# EAGLE board RASPILOTv1_1 (EAGLE 7.2.0)
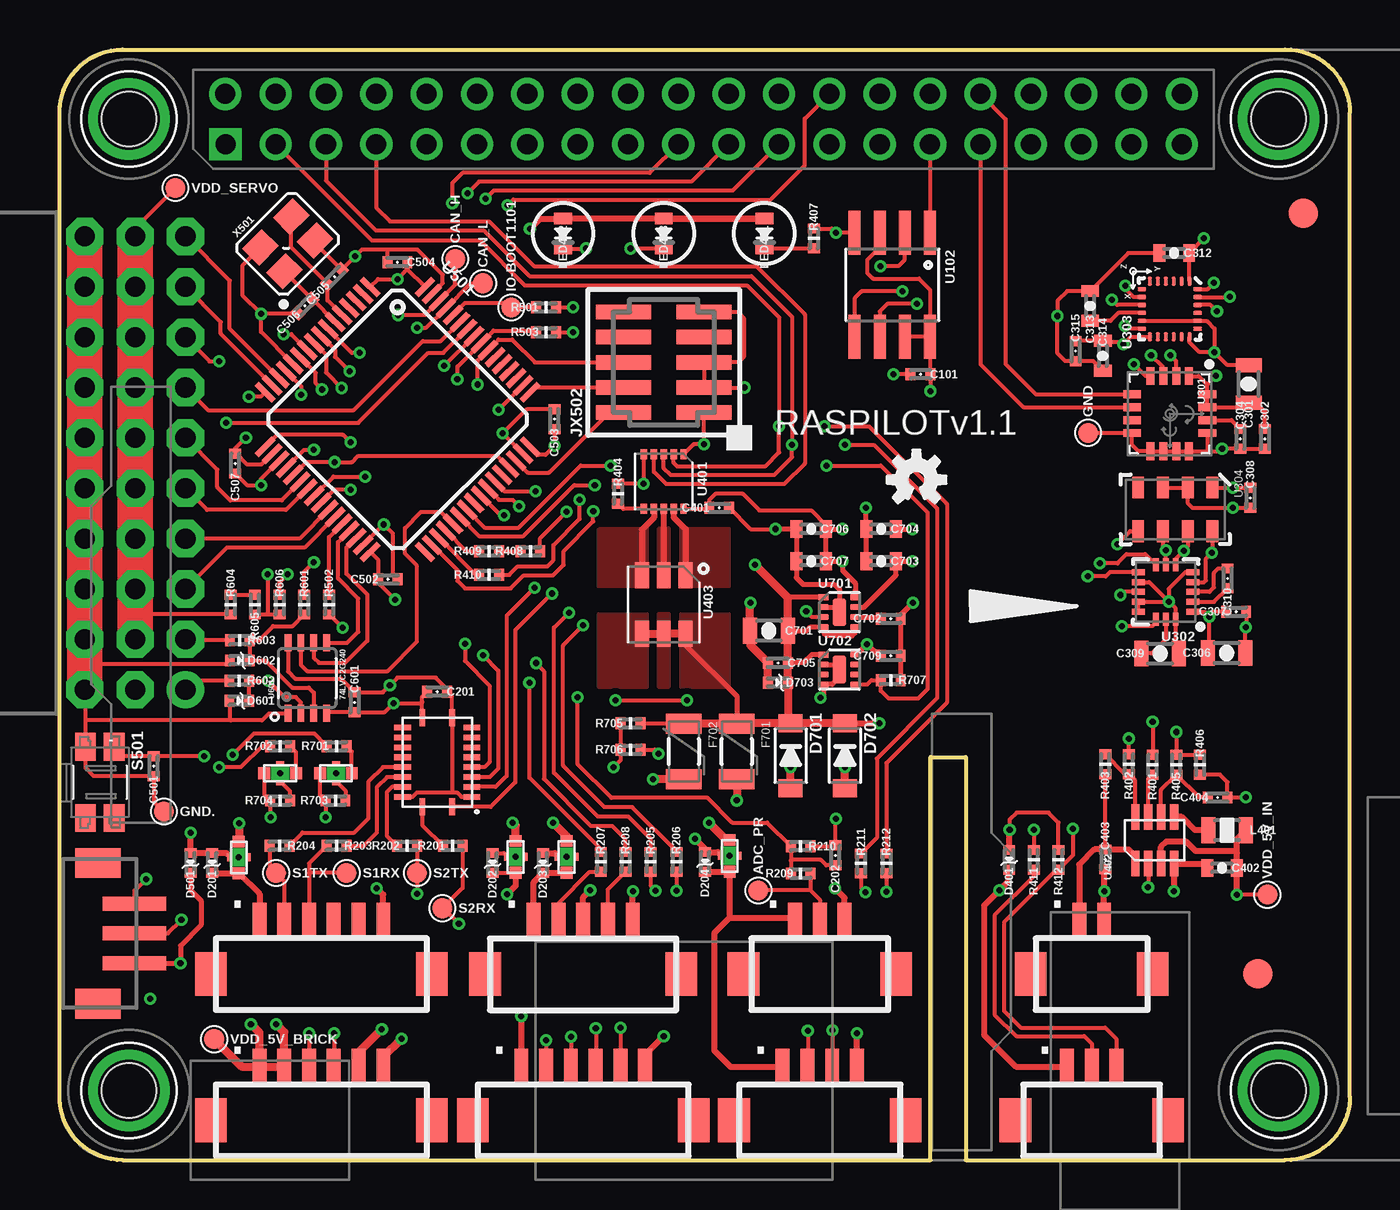
[diagram p8: board, top side]
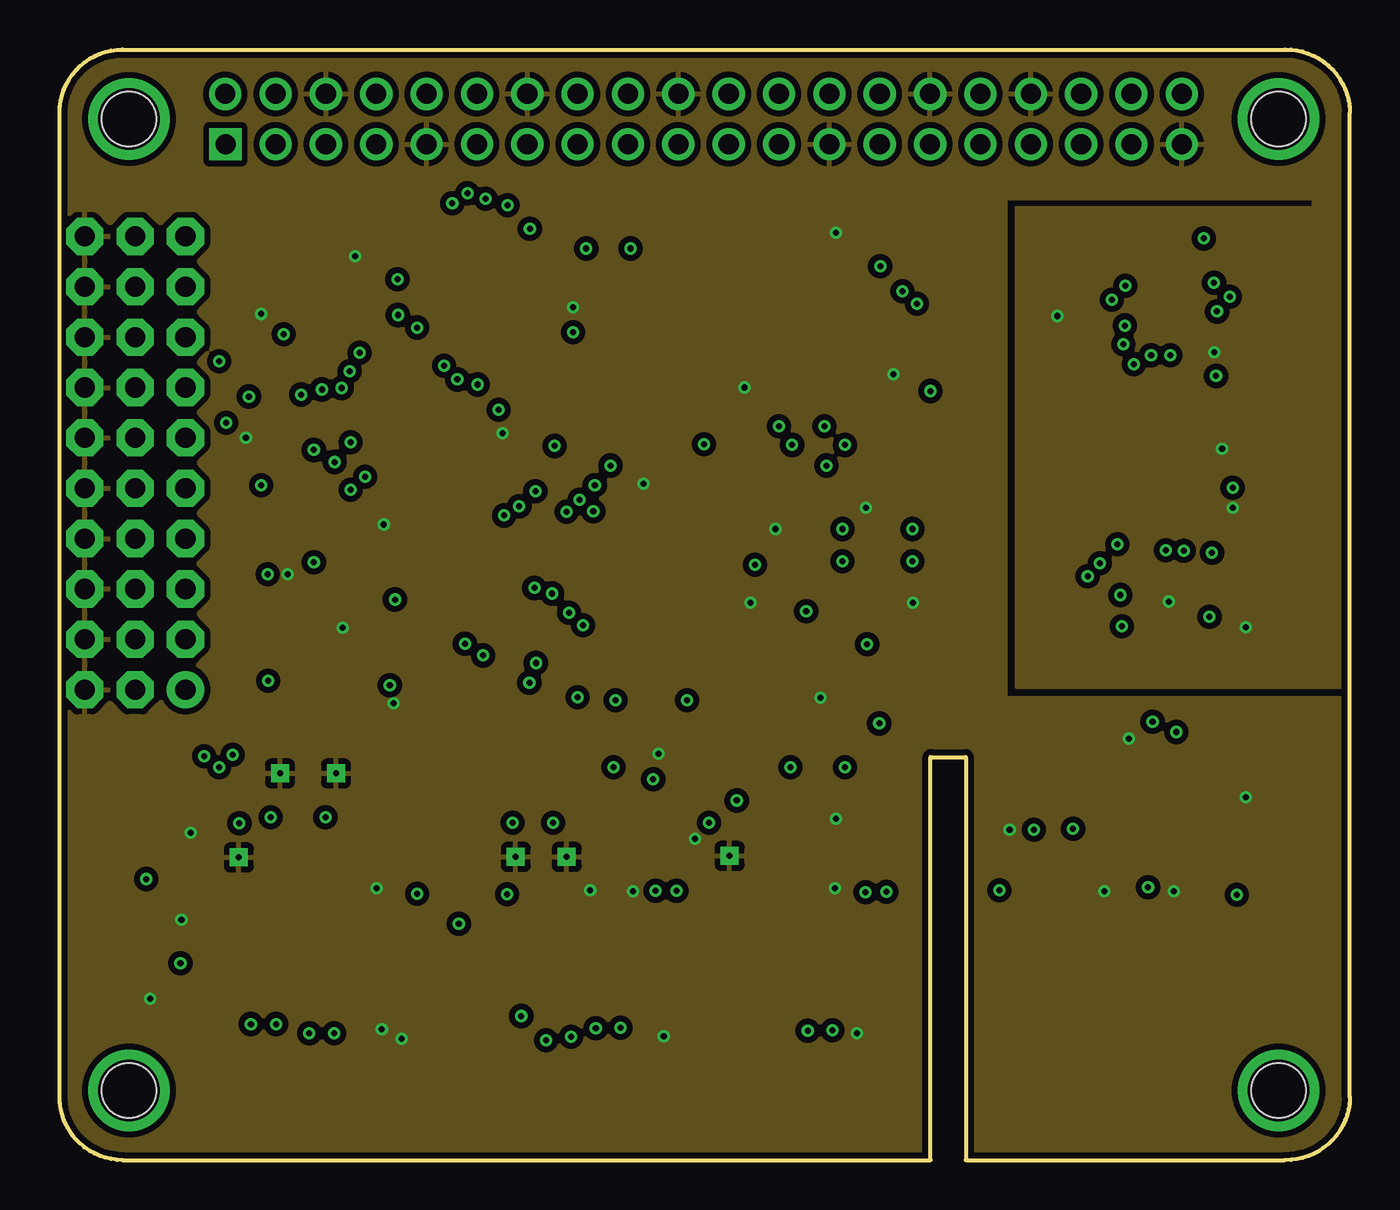
[diagram p9: board, inner layer Ground]
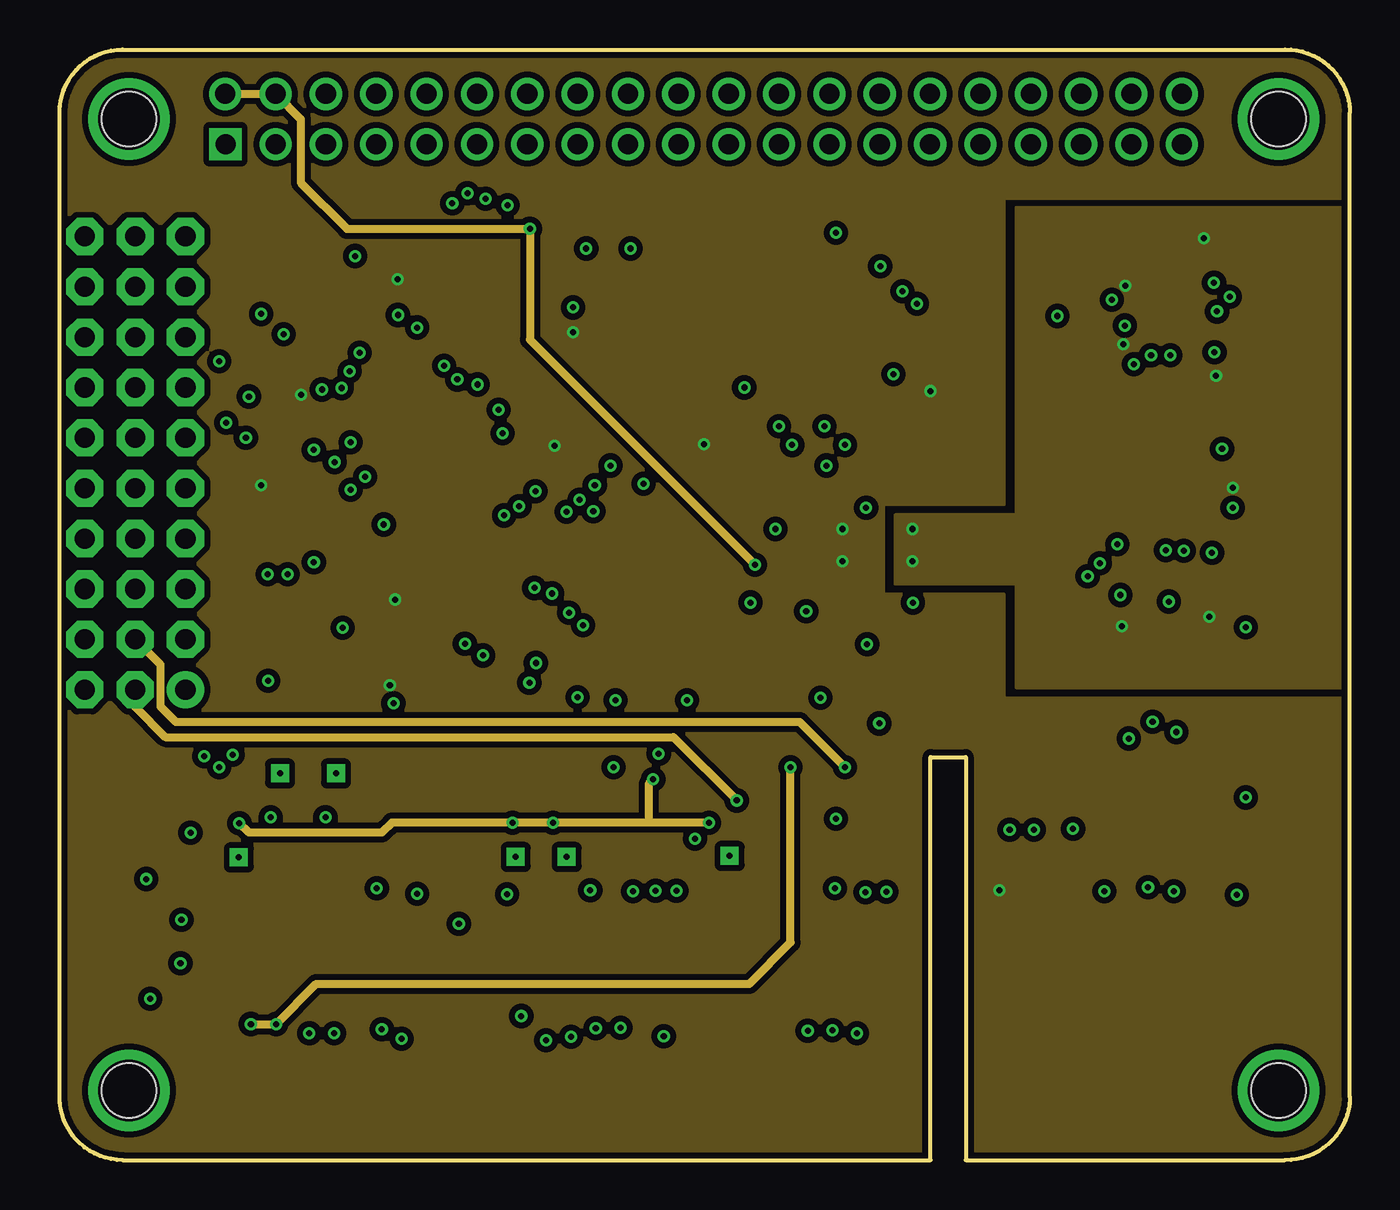
[diagram p10: board, inner layer Power]
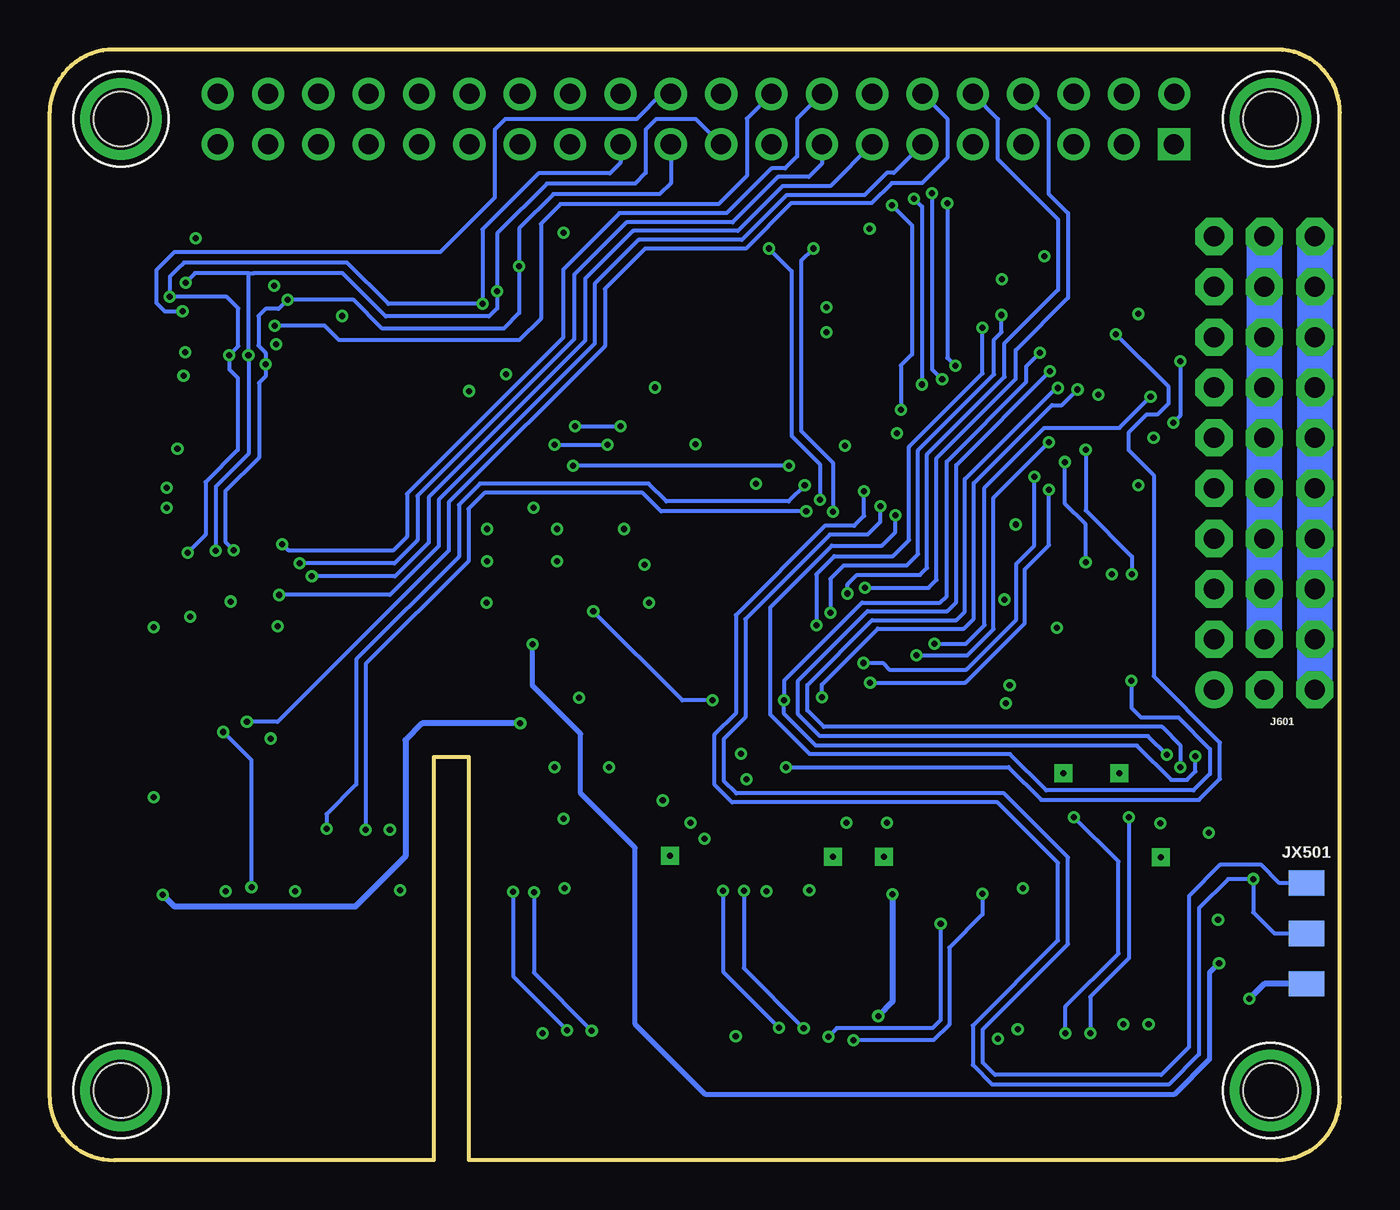
[diagram p11: board, bottom side, seen from below]

Size 65.1 x 56.01 mm. Coordinates in mm from the lower left corner, seen from the top.
Outline: 3.17,56.01 61.82,56.01 arc-90 65.1,52.83 65.1,3.17 arc-90 61.82,0 45.72,0 45.72,20.32 43.94,20.32 43.94,0 3.17,0 arc-90 0,3.17 0,52.83 arc-90 3.17,56.01
Copper layers (1*2*15*16): Top 0.035mm / dielectric 1.5mm / Ground 0.035mm / dielectric 0.15mm / Power 0.035mm / dielectric 0.2mm / Bottom 0.035mm
Design rules "SparkFun-4-layer": minimum track width 6mil, minimum drill 12mil, track to track 6mil, track to pad 6mil, pad to pad 6mil, via to via 6mil, smd to smd 6mil, copper to edge 6mil, drill to drill 8mil, minimum pad ring 12mil, minimum via ring 6mil, stop-mask expansion 4mil, vias tented up to drill 20mil, thermal gap 12mil
Net classes: 0 signal: width 0.15 mm, drill 0.15 mm, clearance 0.152 mm; 1 power: width 0.15 mm, drill 0.2 mm, clearance 0.152 mm

## Footprints (pad centres in the part's own frame; a part is rotated, then mirrored left to right if it is on the bottom)
PAD.04X.04 = smd 1.016 x 1.016: P$1 0,0
0402-CAP = smd 0.5 x 0.6: P$1 -0.5,0; P$2 0.5,0
0805-CAP = smd 0.7 x 1.3: P$1 -0.95,0; P$2 0.95,0
0603-CAP = smd 0.6 x 0.9: P$1 -0.75,0; P$2 0.75,0
0402-TVS = smd 0.5 x 0.6: A 0.5,0; C -0.5,0
SOD-123-DIO = smd 0.91 x 1.22: A 1.64,0; C -1.64,0
PTC-1206 = smd 1 x 1.8: 1 -1.4,0; 2 1.4,0
DF13C-6P-1.25V = smd 0.7 x 1.8: 1 -3.125,0.9; 2 -1.875,0.9; 3 -0.625,0.9; 4 0.625,0.9; 5 1.875,0.9; 6 3.125,0.9 | smd 1.6 x 2.2: M$0 5.575,-1.8; M$1 -5.575,-1.8
DF13C-5P-1.25V = smd 0.7 x 1.8: 1 -2.5,0.9; 2 -1.25,0.9; 3 0,0.9; 4 1.25,0.9; 5 2.5,0.9 | smd 1.6 x 2.2: M$0 4.95,-1.8; M$1 -4.95,-1.8
DF13C-3P-1.25V = smd 0.7 x 1.8: 1 -1.25,0.9; 2 0,0.9; 3 1.25,0.9 | smd 1.6 x 2.2: M$0 3.85,-1.8; M$1 -3.85,-1.8
DF13C-4P-1.25V = smd 0.7 x 1.8: 1 -1.875,0.9; 2 -0.625,0.9; 3 0.625,0.9; 4 1.875,0.9 | smd 1.6 x 2.2: M$0 4.325,-1.8; M$1 -4.325,-1.8
DF13C-2P-1.25V = smd 0.7 x 1.8: 1 -0.625,0.9; 2 0.625,0.9 | smd 1.6 x 2.2: M$0 3.075,-1.8; M$1 -3.075,-1.8
JST-ZH-SMT-VERTICAL = smd 0.7 x 3.2: P$1 -1.5,-1.75; P$2 0,-1.75; P$3 1.5,-1.75 | smd 1.5 x 2.3: P$4 3.55,0.1; P$5 -3.55,0.1
3X10RA = drill 1.016 pad 1.88: 1 2.54,11.43 | drill 1.016 pad 1.88 octagon: 2 0,11.43; 3 -2.54,11.43; 4 2.54,8.89; 5 0,8.89; 6 -2.54,8.89; 7 2.54,6.35; 8 0,6.35; 9 -2.54,6.35; 10 2.54,3.81; 11 0,3.81; 12 -2.54,3.81; 13 2.54,1.27; 14 0,1.27; 15 -2.54,1.27; 16 2.54,-1.27; 17 0,-1.27; 18 -2.54,-1.27; 19 2.54,-3.81; 20 0,-3.81; 21 -2.54,-3.81; 22 2.54,-6.35; 23 0,-6.35; 24 -2.54,-6.35; 25 2.54,-8.89; 26 0,-8.89; 27 -2.54,-8.89; 28 2.54,-11.43; 29 0,-11.43; 30 -2.54,-11.43
FIDUCIAL-1.5X3 = smd 1.5 x 1.5: 1 0,0
HEADER_3X01_SMD_H_BOARD_EDGE_SHORT = smd 1.27 x 1.778: 1 -2.54,0; 2 0,0; 3 2.54,0
FTSH-105-01-XXX-DV-K = smd 0.737 x 2.794: 1 -2.54,-2.032; 2 -2.54,2.032; 3 -1.27,-2.032; 4 -1.27,2.032; 5 0,-2.032; 6 0,2.032; 7 1.27,-2.032; 8 1.27,2.032; 9 2.54,-2.032; 10 2.54,2.032
KYOCERA-KNH16-DA = smd 0.6 x 0.6: P$1 -0.8,0; P$2 0.8,0 | smd 0.4 x 0.4: P$3 0,-0.4; P$4 0,0.4 | drill 0.3 pad 0.4 square: P$5 0,0
0805-IND = smd 0.7 x 1.3: P$1 -0.95,0; P$2 0.95,0
0603-LED = smd 0.6 x 0.9: A 0.75,0; C -0.75,0
MOUNT-HOLE3.1 = drill 3.1 pad 4.1: P$1 0,0
0402-RES = smd 0.5 x 0.6: P$1 -0.5,0; P$2 0.5,0
EVQP7J01K = smd 1.4 x 1.05: A1 -1.8,0.725; A2 1.8,0.725; B3 -1.8,-0.725; B4 1.8,-0.725
RPI2 = drill 1.016 square: P$1 8.37,51.23 | drill 1.016: P$2 8.357,53.772; P$3 10.897,51.232; P$4 10.897,53.772; P$5 13.437,51.232; P$6 13.437,53.772; P$7 15.977,51.232; P$8 15.977,53.772; P$9 18.517,51.232; P$10 18.517,53.772; P$11 21.057,51.232; P$12 21.057,53.772; P$13 23.597,51.232; P$14 23.597,53.772; P$15 26.137,51.232; P$16 26.137,53.772; P$17 28.677,51.232; P$18 28.677,53.772; P$19 31.217,51.232; P$20 31.217,53.772; P$21 33.757,51.232; P$22 33.757,53.772; P$23 36.297,51.232; P$24 36.297,53.772; P$25 38.837,51.232; P$26 38.837,53.772; P$27 41.377,51.232; P$28 41.377,53.772; P$29 43.917,51.232; P$30 43.917,53.772; P$31 46.457,51.232; P$32 46.457,53.772; P$33 48.997,51.232; P$34 48.997,53.772; P$35 51.537,51.232; P$36 51.537,53.772; P$37 54.077,51.232; P$38 54.077,53.772; P$39 56.617,51.232; P$40 56.617,53.772 | hole 2.75: 3.5,3.5; 61.5,3.5; 3.5,52.5; 61.5,52.5
SO08 = smd 0.61 x 2.21: 1 -1.905,-2.616; 2 -0.635,-2.616; 3 0.635,-2.616; 4 1.905,-2.616; 5 1.905,2.616; 6 0.635,2.616; 7 -0.635,2.616; 8 -1.905,2.616
QFN20-RGY = smd 0.28 x 0.85: 1 -0.75,2.25; 10 -0.75,-2.25; 11 0.75,-2.25; 20 0.75,2.25 | smd 0.85 x 0.28: 2 -1.75,1.75; 3 -1.75,1.25; 4 -1.75,0.75; 5 -1.75,0.25; 6 -1.75,-0.25; 7 -1.75,-0.75; 8 -1.75,-1.25; 9 -1.75,-1.75; 12 1.75,-1.75; 13 1.75,-1.25; 14 1.75,-0.75; 15 1.75,-0.25; 16 1.75,0.25; 17 1.75,0.75; 18 1.75,1.25; 19 1.75,1.75
L3G4200DH-MAN = smd 0.9 x 0.4: 1 -1.9,0.975; 2 -1.9,0.325; 3 -1.9,-0.325; 4 -1.9,-0.975; 9 1.9,-0.975; 10 1.9,-0.325; 11 1.9,0.325; 12 1.9,0.975 | smd 0.4 x 0.9: 5 -0.975,-1.9; 6 -0.325,-1.9; 7 0.325,-1.9; 8 0.975,-1.9; 13 0.975,1.9; 14 0.325,1.9; 15 -0.325,1.9; 16 -0.975,1.9
LGA-16L = smd 0.65 x 0.3: 1 -1.37,1; 2 -1.37,0.5; 3 -1.37,0; 4 -1.37,-0.5; 5 -1.37,-1; 9 1.37,-1; 10 1.37,-0.5; 11 1.37,0; 12 1.37,0.5; 13 1.37,1 | smd 0.3 x 0.65: 6 -0.5,-1.37; 7 0,-1.37; 8 0.5,-1.37; 14 0.5,1.37; 15 0,1.37; 16 -0.5,1.37
MPU-6500 = smd 0.45 x 0.22: 1 -1.4,1; 2 -1.4,0.6; 3 -1.4,0.2; 4 -1.4,-0.2; 5 -1.4,-0.6; 6 -1.4,-1; 13 1.4,-1; 14 1.4,-0.6; 15 1.4,-0.2; 16 1.4,0.2; 17 1.4,0.6; 18 1.4,1 | smd 0.22 x 0.45: 7 -1,-1.4; 8 -0.6,-1.4; 9 -0.2,-1.4; 10 0.2,-1.4; 11 0.6,-1.4; 12 1,-1.4; 19 1,1.4; 20 0.6,1.4; 21 0.2,1.4; 22 -0.2,1.4; 23 -0.6,1.4; 24 -1,1.4
MS5611-01BA = smd 1.1 x 0.6: 1 -1.1,1.875; 2 -1.1,0.625; 3 -1.1,-0.625; 4 -1.1,-1.875; 5 1.1,-1.875; 6 1.1,-0.625; 7 1.1,0.625; 8 1.1,1.875
SON10 = smd 0.32 x 0.5: 1 -1,-1.375; 2 -0.5,-1.375; 3 0,-1.375; 4 0.5,-1.375; 5 1,-1.375; 6 1,1.375; 7 0.5,1.375; 8 0,1.375; 9 -0.5,1.375; 10 -1,1.375
SOT23-8 = smd 0.42 x 1.3: 1 -0.975,-1.175; 2 -0.325,-1.175; 3 0.325,-1.175; 4 0.975,-1.175; 5 0.975,1.175; 6 0.325,1.175; 7 -0.325,1.175; 8 -0.975,1.175
6-PLCC = smd 1.3 x 0.7: A1 1.475,1.1; A2 1.475,0; A3 1.475,-1.1; C1 -1.475,1.1; C2 -1.475,0; C3 -1.475,-1.1
TQFP64 = smd 1.2 x 0.29: 1 -5.7,3.75; 2 -5.7,3.25; 3 -5.7,2.75; 4 -5.7,2.25; 5 -5.7,1.75; 6 -5.7,1.25; 7 -5.7,0.75; 8 -5.7,0.25; 9 -5.7,-0.25; 10 -5.7,-0.75; 11 -5.7,-1.25; 12 -5.7,-1.75; 13 -5.7,-2.25; 14 -5.7,-2.75; 15 -5.7,-3.25; 16 -5.7,-3.75; 33 5.7,-3.75; 34 5.7,-3.25; 35 5.7,-2.75; 36 5.7,-2.25; 37 5.7,-1.75; 38 5.7,-1.25; 39 5.7,-0.75; 40 5.7,-0.25; 41 5.7,0.25; 42 5.7,0.75; 43 5.7,1.25; 44 5.7,1.75; 45 5.7,2.25; 46 5.7,2.75; 47 5.7,3.25; 48 5.7,3.75 | smd 0.29 x 1.2: 17 -3.75,-5.7; 18 -3.25,-5.7; 19 -2.75,-5.7; 20 -2.25,-5.7; 21 -1.75,-5.7; 22 -1.25,-5.7; 23 -0.75,-5.7; 24 -0.25,-5.7; 25 0.25,-5.7; 26 0.75,-5.7; 27 1.25,-5.7; 28 1.75,-5.7; 29 2.25,-5.7; 30 2.75,-5.7; 31 3.25,-5.7; 32 3.75,-5.7; 49 3.75,5.7; 50 3.25,5.7; 51 2.75,5.7; 52 2.25,5.7; 53 1.75,5.7; 54 1.25,5.7; 55 0.75,5.7; 56 0.25,5.7; 57 -0.25,5.7; 58 -0.75,5.7; 59 -1.25,5.7; 60 -1.75,5.7; 61 -2.25,5.7; 62 -2.75,5.7; 63 -3.25,5.7; 64 -3.75,5.7
TSSOP8_SOT505-2 = smd 0.35 x 0.85: 1 -0.975,-1.775; 2 -0.325,-1.775; 3 0.325,-1.775; 4 0.975,-1.775; 5 0.975,1.775; 6 0.325,1.775; 7 -0.325,1.775; 8 -0.975,1.775
MLF-8-EPAD = smd 0.5 x 0.3: 1 -0.8,0.75; 2 -0.8,0.25; 3 -0.8,-0.25; 4 -0.8,-0.75; 5 0.8,-0.75; 6 0.8,-0.25; 7 0.8,0.25; 8 0.8,0.75 | smd 0.7 x 1.4: GND 0,0
OSCILLATOR-3.2X2.5 = smd 1.4 x 1.2: 1 -1.1,-0.85; 2 1.1,-0.85; 3 1.1,0.85; 4 -1.1,0.85

## Placement (x,y rotation side)
ADC_PR  PAD.04  [PAD.04X.04]  35.26,13.59 90 top
C101  0u1  [0402-CAP]  43.43,39.62 180 top
C201  0u1  [0402-CAP]  19.05,23.62 180 top
C202  0u1  [0402-CAP]  39.14,15.37 90 top
C301  10u/10V  [0805-CAP]  59.99,39.14 90 top
C302  0u1  [0402-CAP]  60.81,36.37 270 top
C304  10n  [0402-CAP]  59.56,36.37 270 top
C306  10u/10V  [0805-CAP]  58.88,25.58 0 top
C307  0u1  [0402-CAP]  59.36,27.66 0 top
C308  0u1  [0402-CAP]  60.07,33.4 270 top
C309  10u/10V  [0805-CAP]  55.52,25.55 0 top
C310  0u47  [0402-CAP]  58.93,29.34 90 top
C312  10n  [0603-CAP]  56.24,45.75 180 top
C313  2u2  [0603-CAP]  51.99,43.08 90 top
C314  2u2  [0603-CAP]  52.63,40.56 270 top
C315  0u1  [0402-CAP]  51.26,40.79 270 top
C401  0u1  [0402-CAP]  33.27,32.89 0 top
C402  1u  [0603-CAP]  58.65,14.73 180 top
C403  5n6  [0402-CAP]  52.76,15.16 270 top
C404  0u47  [0402-CAP]  58.42,18.29 0 top
C501  0u1  [0402-CAP]  4.75,19.86 90 top
C502  0u1  [0402-CAP]  16.56,29.29 0 top
C503  0u1  [0402-CAP]  24.97,37.36 90 top
C504  0u1  [0402-CAP]  17.04,45.29 180 top
C505  8p  [0402-CAP]  13.87,44.55 45 top
C506  8p  [0402-CAP]  12.37,43.08 45 top
C507  0u1  [0402-CAP]  8.86,35.13 90 top
C601  0u1  [0402-CAP]  14.88,23.09 270 top
C701  10u/25V  [0805-CAP]  35.79,26.7 180 top
C702  10n  [0402-CAP]  41.94,27.3 0 top
C703  1u  [0603-CAP]  41.45,30.2 180 top
C704  10u  [0603-CAP]  41.45,31.83 180 top
C705  0u1  [0402-CAP]  36.25,25.07 180 top
C706  1u  [0603-CAP]  37.92,31.83 180 top
C707  10u  [0603-CAP]  37.92,30.2 180 top
C709  2u2  [0402-CAP]  41.94,25.43 0 top
CAN_H  PAD.04  [PAD.04X.04]  19.96,45.44 90 top
CAN_L  PAD.04  [PAD.04X.04]  21.36,44.22 90 top
D201  PESD0402-140  [0402-TVS]  7.7,14.99 90 top
D202  PESD0402-140  [0402-TVS]  21.84,14.99 90 top
D203  PESD0402-140  [0402-TVS]  24.38,14.99 90 top
D204  PESD0402-140  [0402-TVS]  32.56,15.04 90 top
D401  PESD0402-140  [0402-TVS]  47.9,15.14 90 top
D501  PESD0402-140  [0402-TVS]  6.6,14.99 90 top
D601  PESD0402-140  [0402-TVS]  9.07,23.16 180 top
D602  PESD0402-140  [0402-TVS]  9.09,25.2 180 top
D701  MBR120VLSFT1G  [SOD-123-DIO]  36.88,20.4 270 top
D702  MBR120VLSFT1G  [SOD-123-DIO]  39.62,20.4 270 top
D703  PESD0402-140  [0402-TVS]  36.25,24.08 180 top
F701  0ZCA0035FF2G  [PTC-1206]  34.16,20.6 270 top
F702  0ZCA0035FF2G  [PTC-1206]  31.5,20.6 270 top
GND  PAD.04  [PAD.04X.04]  51.89,36.68 90 top
GND.  PAD.04  [PAD.04X.04]  5.26,17.58 0 top
IO-BOOT1101  PAD.04  [PAD.04X.04]  22.78,43 90 top
J201  DF13C-6P-1.25V  [DF13C-6P-1.25V]  13.21,11.18 0 top
J202  DF13C-6P-1.25V  [DF13C-6P-1.25V]  26.42,3.81 0 top
J203  DF13C-5P-1.25V  [DF13C-5P-1.25V]  26.42,11.18 0 top
J204  DF13C-3P-1.25V  [DF13C-3P-1.25V]  38.35,11.18 0 top
J205  DF13C-4P-1.25V  [DF13C-4P-1.25V]  38.35,3.81 0 top
J401  DF13C-2P-1.25V  [DF13C-2P-1.25V]  52.07,11.18 0 top
J402  DF13C-3P-1.25V  [DF13C-3P-1.25V]  52.07,3.81 0 top
J501  JST-ZH-3  [JST-ZH-SMT-VERTICAL]  2.03,11.43 90 top
J601  HEADER-3X10  [3X10RA]  3.81,35.15 180 bottom
J701  DF13C-6P-1.25V  [DF13C-6P-1.25V]  13.21,3.81 0 top
JP1  FIDUCIAL1.5X3  [FIDUCIAL-1.5X3]  62.74,47.75 0 top
JP2  FIDUCIAL1.5X3  [FIDUCIAL-1.5X3]  60.45,9.4 0 top
JX501  HEADER-3X1BOARDEDGE-SHORT  [HEADER_3X01_SMD_H_BOARD_EDGE_SHORT]  1.68,11.43 270 bottom
JX502  ARM_MINI_JTAG-SMT  [FTSH-105-01-XXX-DV-K]  30.48,40.23 90 top
L201  KNH16C104DA5TS  [KYOCERA-KNH16-DA]  9.04,15.27 270 top
L202  KNH16C104DA5TS  [KYOCERA-KNH16-DA]  23.01,15.29 270 top
L203  KNH16C104DA5TS  [KYOCERA-KNH16-DA]  25.58,15.29 270 top
L204  KNH16C104DA5TS  [KYOCERA-KNH16-DA]  33.81,15.34 270 top
L401  47uH  [0805-IND]  58.9,16.64 180 top
L701  KNH16C104DA5TS  [KYOCERA-KNH16-DA]  11.13,19.51 0 top
L702  KNH16C104DA5TS  [KYOCERA-KNH16-DA]  13.94,19.51 0 top
LED401  GREEN  [0603-LED]  35.56,46.74 90 top
LED402  AMBER  [0603-LED]  25.4,46.74 90 top
LED403  BLUE  [0603-LED]  30.48,46.74 90 top
M3_MOUNT1101  MOUNT-HOLE3.1MM  [MOUNT-HOLE3.1]  3.51,3.51 0 top
M3_MOUNT1102  MOUNT-HOLE3.1MM  [MOUNT-HOLE3.1]  61.49,3.51 0 top
M3_MOUNT1103  MOUNT-HOLE3.1MM  [MOUNT-HOLE3.1]  61.49,52.5 0 top
M3_MOUNT1104  MOUNT-HOLE3.1MM  [MOUNT-HOLE3.1]  3.51,52.5 0 top
OSHW_LOGO  OSHW-LOGOS  [OSHW-LOGO-S]  43.23,34.32 0 top
R201  120R  [0402-RES]  19.84,15.85 0 top
R202  120R  [0402-RES]  17.53,15.85 0 top
R203  120R  [0402-RES]  13.97,15.85 180 top
R204  120R  [0402-RES]  11.1,15.85 180 top
R205  120R  [0402-RES]  29.82,15.04 270 top
R206  120R  [0402-RES]  31.11,15.04 270 top
R207  10K/0.1%  [0402-RES]  27.3,15.04 270 top
R208  10K/0.1%  [0402-RES]  28.55,15.04 270 top
R209  10K/0.1%  [0402-RES]  37.39,14.45 0 top
R210  10K/0.1%  [0402-RES]  37.39,15.82 180 top
R211  120R  [0402-RES]  40.44,14.96 270 top
R212  120R  [0402-RES]  41.71,14.96 270 top
R401  9K09  [0402-RES]  55.14,19.94 90 top
R402  10K  [0402-RES]  53.95,19.96 90 top
R403  100K  [0402-RES]  52.76,19.96 90 top
R404  10K  [0402-RES]  28.17,33.6 270 top
R405  453K  [0402-RES]  56.34,19.94 90 top
R406  16K5  [0402-RES]  57.53,19.94 270 top
R407  220R  [0402-RES]  38.05,46.48 270 top
R408  220R  [0402-RES]  23.75,30.71 0 top
R409  220R  [0402-RES]  21.67,30.71 0 top
R410  220R  [0402-RES]  21.67,29.51 0 top
R411  68R  [0402-RES]  49.15,15.14 90 top
R412  1K5  [0402-RES]  50.39,15.14 90 top
R501  10K  [0402-RES]  24.54,43 0 top
R502  10K  [0402-RES]  13.59,28.02 270 top
R503  10K  [0402-RES]  24.54,41.76 0 top
R601  10K  [0402-RES]  12.34,28.02 270 top
R602  220R  [0402-RES]  9.07,24.18 180 top
R603  220R  [0402-RES]  9.09,26.21 180 top
R604  10K/0.1%  [0402-RES]  8.64,28.02 270 top
R605  10K/0.1%  [0402-RES]  9.86,28.02 90 top
R606  10K/0.1%  [0402-RES]  11.1,28.02 270 top
R701  10K/0.1%  [0402-RES]  13.97,20.88 0 top
R702  10K/0.1%  [0402-RES]  11.13,20.88 0 top
R703  1M  [0402-RES]  13.92,18.14 0 top
R704  1M  [0402-RES]  11.13,18.14 0 top
R705  10K/0.1%  [0402-RES]  28.8,22.02 0 top
R706  10K/0.1%  [0402-RES]  28.8,20.7 0 top
R707  10K  [0402-RES]  41.94,24.21 180 top
S1RX  PAD.04  [PAD.04X.04]  14.48,14.48 0 top
S1TX  PAD.04  [PAD.04X.04]  10.92,14.48 0 top
S2RX  PAD.04  [PAD.04X.04]  19.3,12.7 0 top
S2TX  PAD.04  [PAD.04X.04]  18.03,14.48 0 top
S501  RESET  [EVQP7J01K]  2.03,19.05 270 top
U101  RPI2  [RPI2]  0,0 0 top
U102  FM25V01  [SO08]  42.01,44.15 180 top
U201  TXS0108QFN20  [QFN20-RGY]  19.05,20.07 180 top
U301  L3GD20  [L3G4200DH-MAN]  56.01,37.64 270 top
U302  LSM303D  [LGA-16L]  55.8,28.65 180 top
U303  MPU-9250  [MPU-6500]  56.01,42.93 270 top
U304  MS5611-01BA  [MS5611-01BA]  56.29,32.82 270 top
U401  TCA62724FMG  [SON10]  30.48,34.21 180 top
U402  LT3469  [SOT23-8]  55.24,16.13 0 top
U403  LRTB GFTG-T7AW-1+V7A7-29+R5T9-49-L  [6-PLCC]  30.48,28.02 270 top
U501  STM32F10XRXT6L  [TQFP64]  17.05,37.35 315 top
U601  74LVC2G240  [TSSOP8_SOT505-2]  12.5,24.31 0 top
U701  MIC5332  [MLF-8-EPAD]  39.34,27.64 0 top
U702  MIC5332  [MLF-8-EPAD]  39.34,24.74 0 top
VDD_5V_BRICK  PAD.04  [PAD.04X.04]  7.8,6.1 0 top
VDD_5V_IN  PAD.04  [PAD.04X.04]  60.93,13.39 90 top
VDD_SERVO  PAD.04  [PAD.04X.04]  5.84,49.02 0 top
X501  3.2x2.5 mm / 8 MHz / 15 ppm  [OSCILLATOR-3.2X2.5]  11.51,46.21 45 top

## Tracks (layer width: path | path; a pad name or v marks a point on that pad's centre or on a via)
!ACCEL_MAG_CS  (via drill 0.3 pad 0.46)
  Top 0.203: U302.8 54.77,30.56 53.82,30.56 53.37,30.1 v52.48,30.1
  Bottom 0.203: U101.P$15 26.14,50.24 26.8,49.58 28.35,49.58 30.63,47.3 35.99,47.3 38.63,44.65 38.63,41.4 46.53,33.5 46.53,31.27 47.7,30.1 v52.48,30.1
!BARO_CS  (via drill 0.3 pad 0.46)
  Top 0.203: v53.37,31.06 54.02,31.72 U304.5
  Bottom 0.203: U101.P$16 27.38,52.53 27.38,50.62 27.99,50.01 28.68,50.01 30.94,47.75 36.35,47.75 39.19,44.91 39.19,41.48 47.07,33.6 47.07,31.45 47.78,30.73 53.03,30.73 v53.37,31.06
!FRAM_CS
  Top 0.203: U101.P$29 U102.1
!GYRO_CS
  Top 0.203: U101.P$32 47.73,52.5 47.73,40.16 49.27,38.62 U301.5
!IO-LED_AMBER
  Top 0.203: U501.36 20.51,30.71 R409.P$1
!IO-LED_BLUE
  Top 0.203: U501.35 21,29.52 R410.P$1
!IO-LED_SAFETY  (via drill 0.3 pad 0.46)
  Top 0.203: v49.15,16.66 R411.P$2 | U501.34 20.07,29.74 20.07,29.21 20.45,28.83 22.76,28.83 23.42,29.49 24.89,29.49 25.43,30.02 25.43,30.71 26.92,32.21 v26.92,32.72
  Bottom 0.203: v49.15,16.66 49.15,25.02 43.97,30.2 43.97,32.84 43.16,33.66 35.18,33.66 34.24,32.72 v26.92,32.72
!MPU_CS  (via drill 0.3 pad 0.46)
  Top 0.203: v58.4,42.8 58.07,43.13 U303.22
  Bottom 0.203: U101.P$22 34.21,53.77 35.48,52.5 42.11,52.5 42.65,51.97 42.65,48.54 45.39,45.8 58.8,45.8 59.16,45.44 59.28,45.31 59.72,44.88 59.72,43.23 59.28,42.8 v58.4,42.8
!SBUS_OUTPUT_EN
  Top 0.203: U601.7 12.17,24.99 12.5,24.66 16.54,24.66 18.03,26.16 18.03,29.97 17.42,30.58 17.42,31.88 18.24,32.69 19.23,32.69 U501.37
ACCEL_DRDY  (via drill 0.3 pad 0.46)
  Top 0.203: U302.11 53.67,28.65 v53.52,28.5
  Bottom 0.203: U101.P$11 22.5,49.78 22.86,49.78 23.98,48.67 27.91,48.67 30.18,46.41 35.38,46.41 37.59,44.2 37.59,41.17 45.47,33.3 45.47,30.96 47.93,28.5 v53.52,28.5
ALARM  (via drill 0.3 pad 0.46)
  Top 0.203: v55.14,22.1 R401.P$2
  Bottom 0.203: U101.P$12 19.81,52.53 19.81,50.55 21.08,49.28 22.61,49.28 23.62,48.26 27.69,48.26 29.97,45.97 35.05,45.97 37.08,43.94 37.08,41.05 44.96,33.17 44.96,32 44.96,31.75 44.96,30.73 53.59,22.1 v55.14,22.1
BATT_CURRENT_SENS  (via drill 0.3 pad 0.46)
  Top 0.203: U501.9 13.44,40.62 13.44,39.73 v14.22,38.94 | R702.P$1 10.21,20.88 9.14,19.81 v8.05,19.81
  Bottom 0.203: v14.22,38.94 14.33,38.94 18.92,34.34 18.92,27.66 19.36,27.23 23.6,27.23 26.87,23.95 26.87,22.68 26.04,21.84 8.97,21.84 8.05,20.93 v8.05,19.81
BATT_CURRENT_SENS_PROT1  (via drill 0.3 pad 0.46)
  Top 0.203: L701.P$1 10.32,18.44 R704.P$1 10.62,17.32 | v12.6,6.4 12.6,4.72
  Top 0.305: 12.6,4.72 J701.3 | 10.62,17.32 v10.64,17.3
  Bottom 0.203: v10.64,17.3 10.64,10.19 12.6,8.23 v12.6,6.4
BATT_VOLTAGE_SENS  (via drill 0.3 pad 0.46)
  Top 0.203: U501.8 13.89,40.87 13.89,40.51 v14.63,39.78 | R701.P$1 12.84,21.51 9.8,21.51 v8.74,20.45
  Bottom 0.203: v14.63,39.78 19.36,35.05 19.36,28.14 19.81,27.69 23.82,27.69 27.33,24.18 27.33,22.48 26.24,21.39 9.68,21.39 v8.74,20.45
BATT_VOLTAGE_SENS_PROT1  (via drill 0.3 pad 0.46)
  Top 0.203: v13.84,6.4 13.84,4.72 J701.4 | L702.P$1 13.14,18.41 R703.P$1 v13.42,17.3
  Top 0.305: v13.42,17.3 v13.41,17.3
  Bottom 0.203: v13.84,6.4 13.84,7.75 11.18,10.41 11.18,15.06 v13.41,17.3
FMU_AUX_ADC1_PROT1
  Top 0.203: J203.4 27.67,13.65 R208.P$2
FMU_AUX_ADC2_PROT1
  Top 0.203: J203.2 25.17,12.95 26.75,14.53 R207.P$2
GND  (via drill 0.3, 0.3 pad 0.46)
  Top 0.203: X501.2 12.88,46.24 C505.P$2 v14.91,45.59 15.24,45.92 16.51,45.92 | 57.68,14.95 C402.P$2 | R406.P$2 58.54,19.44 58.92,19.06 C404.P$2 v59.84,18.29 | D202.A 22.42,15.49 L202.P$3 L202.P$5 L202.P$4 | U601.4 13.53,22.59 C601.P$2 16.39,22.59 v16.84,23.04 18.22,23.04 18.3,23.11 | U304.3 U304.2 56.92,33.91 56.92,33.12 57.15,32.89 v59.18,32.89 59.19,32.9 C308.P$2 | C506.P$1 11.96,42.67 v10.16,42.67 | v10.16,42.67 9.25,43.59 9.25,45.14 10.13,46.02 X501.4 | U501.12 10.16,41.77 v10.16,42.67 | C302.P$2 C304.P$2 58.66,35.87 v58.65,35.87 58.53,35.74 57.91,35.74 | U201.11 18.3,23.11 | 18.3,23.11 18.3,23.37 C201.P$2 | R402.P$2 v53.95,21.26 | 1.31,22.17 S501.B3 1.31,19.77 1.72,19.36 C501.P$1 4.76,18.08 GND..P$1 | 1.31,22.17 1.31,23.69 J601.3 | C306.P$2 59.83,26.86 v59.84,26.87 59.86,26.89 C307.P$2 | 39.16,17.21 v39.17,17.22 39.14,17.2 C202.P$2 39.1,15.82 R210.P$1 | L204.P$3 L204.P$5 L204.P$4 | U501.31 v16.35,32.05 v16.36,32.05 16.82,31.6 16.82,29.53 C502.P$2 | C503.P$2 23.56,37.86 v22.35,36.65 U501.47 | 18.8,43.68 U501.63 19.33,44.23 19.33,44.65 18.06,45.92 16.51,45.92 | R606.P$1 11.1,29.13 v11.51,29.54 | D602.A 8.39,24.99 1.27,24.99 | 8.64,22.17 10.21,22.17 10.57,22.53 U601.1 | 8.64,22.17 1.31,22.17 | R704.P$2 11.62,18.61 L701.P$3 | L702.P$3 14.42,18.63 R703.P$2 | R706.P$2 30.02,20.7 v30.23,20.5 | v9.4,36.42 8.87,35.89 C507.P$2 8.92,35.63 9.47,35.08 10.18,35.08 U501.18 | J501.P$2 5.46,11.43 v6.15,12.12 | C504.P$2 16.54,45.89 16.51,45.92 | D601.A 8.57,22.24 8.64,22.17 | R412.P$2 50.39,17.02 49.89,17.53 48.28,17.53 47.93,17.17 v47.93,16.66 | C101.P$2 v42.06,39.62 | v55.96,28.17 55.94,28.15 U302.12 U302.13
  Top 0.203: v55.96,28.17 56.3,27.82 U302.16 56.3,25.72 C309.P$2 | U302.10 54.97,29.15 v55.96,28.17 | U302.5 56.8,29.65 55.96,28.8 v55.96,28.17 | C301.P$2 58.92,40.09 v58.27,40.74 | 57.91,35.74 U301.12 U301.11 U301.10 U301.9 54.43,35.74 54.1,36.07 U301.8 51.9,36.67 GND.P$1 | U301.13 57.91,35.75 57.91,35.74 | R407.P$1 38.95,46.98 v39.17,46.76 U102.4 | JX502.9 34.21,42.77 34.52,42.47 34.52,40.51 34.24,40.23 JX502.5 JX502.3 v34.54,38.96 | R404.P$1 v29.46,34.1 v29.46,34.11 29.46,35.57 U401.5 | v36.12,31.83 34.86,31.83 33.79,32.89 C401.P$2 | R501.P$2 v25.91,43 | R502.P$2 13.61,27.52 v14.28,26.85 | v58.27,40.74 57.51,40.74 57.01,41.24 U303.18 | U303.11 U303.20 57.88,42.33 58.27,41.94 v58.27,40.74 | C312.P$2 53.91,45.74 C313.P$2 50.84,43.83 50.34,43.33 v50.34,42.57 50.34,40.69 50.74,40.29 C315.P$2 52.15,40.29 C314.P$2 | L203.P$3 L203.P$5 L203.P$4
  Top 0.254: C703.P$2 C704.P$2 v40.69,32.89 | U701.2 39.09,27.89 U701.GND 39.34,28.78 39.09,29.03 37.52,29.03 37.17,29.38 C707.P$2 C706.P$2 v36.12,31.83 | U702.2 39.09,24.99 U702.GND 39.34,24.36 38.98,23.99 U702.4 38.55,23.48 v38.38,23.32 | R707.P$1 C709.P$2 C702.P$2 42.44,27.5 v43.05,28.12
  Top 0.305: 57.68,14.95 U402.4 56.22,13.57 v56.21,13.56 | D203.A 24.98,15.49 L203.P$3 | L204.P$3 33.21,15.54 D204.A 32.56,15.7 v32.05,16.2 | J203.5 28.92,13.55 v28.93,13.56 | J202.6 29.54,5.31 v30.48,6.25 | J205.4 v40.23,6.4 | J401.2 v52.7,13.55 v52.7,13.56 52.7,14.61 C403.P$2 | J201.6 16.33,13.38 v16,13.72 | J204.3 39.6,13.23 v39.12,13.72 | J203.3 26.42,13.26 v26.77,13.61 | L701.P$3 L701.P$5 L701.P$4 | L702.P$3 L702.P$5 L702.P$4 | v6.6,16.51 D501.A D201.A 8.42,15.49 L201.P$3 | 8.64,15.24 8.66,15.27 L201.P$5 L201.P$4 | D401.A 47.93,15.66 v47.93,16.66
  Top 0.406: J701.6 16.33,5.21 v17.25,6.12 | J701.5 15.08,5.43 v16.26,6.6 | 34.83,26.69 C701.P$2 | C701.P$2 34.84,28.11 v34.85,28.12 | D703.A C705.P$2 34.84,25.98 C701.P$2
  Top 1.778: J601.30 J601.27 J601.24 J601.21 J601.18 J601.15 J601.12 J601.9 J601.6 1.27,24.99 J601.3
  Bottom 0.305: JX501.3 3.81,8.89 v4.57,8.13
  Bottom 1.778: J601.3 J601.30
  pour Ground (isolate 0.305): 0,0 65.1,0 65.1,23.29 47.75,23.29 47.75,48.51 63.25,48.51 63.25,48.01 48.26,48.01 48.26,23.88 65.1,23.88 65.1,56.03 0,56.03
GYRO_DRDY
  Top 0.203: U101.P$31 46.46,40.13 48.62,37.97 U301.6
IO-!RESET  (via drill 0.3, 0.3 pad 0.46)
  Top 0.203: S501.A1 3.24,20.36 C501.P$2 v7.29,20.37 | v15.14,40.72 14.74,40.72 U501.7 | v28.04,23.19 v31.65,23.19 | U701.3 37.97,27.39 v37.67,27.69
  Bottom 0.203: v15.14,40.72 15.82,40.03 15.82,39.24 19.84,35.23 19.84,28.45 20.17,28.12 24.11,28.12 28.04,24.18 v28.04,23.19 28.04,22.5 26.44,20.9 10.24,20.9 8.51,19.18 7.72,19.18 7.29,19.61 v7.29,20.37 | v31.65,23.19 33.17,23.19 v37.67,27.69
IO-BOOT0
  Top 0.203: R501.P$1 IO-BOOT1101.P$1 22.55,43.23 20.45,43.23 U501.60
IO-BOOT1
  Top 0.203: R502.P$1 13.59,31.42 U501.28
IO-CAN_RX  (via drill 0.3 pad 0.46)
  Top 0.203: CAN_L.P$1 20.74,44.22 U501.61 18.5,41.99 v18.03,41.99 | R206.P$1 31.11,15.57 28.88,17.8 27.48,17.8 25.4,19.89 25.4,25.96 v26.42,26.98
  Bottom 0.203: v18.03,41.99 18.03,39.67 21.74,35.97 21.74,31.27 22.55,30.45 25.5,30.45 26.42,29.54 v26.42,26.98
IO-CAN_TX  (via drill 0.3 pad 0.46)
  Top 0.203: R205.P$1 29.82,16.2 28.7,17.32 27.15,17.32 24.94,19.53 24.94,26.85 v25.7,27.61 | v17.07,42.62 18.43,42.62 U501.62 19.96,44.16 CAN_H.P$1
  Bottom 0.203: v17.07,42.62 17.07,41.76 17.45,41.38 17.45,39.62 21.29,35.79 21.29,30.56 21.84,30 25.02,30 25.7,29.31 v25.7,27.61
IO-CH1
  Top 0.203: U501.14 8.59,41.92 8.59,44.35 J601.28
IO-CH2
  Top 0.203: U501.15 8.13,41.67 8.13,42.27 J601.25
IO-CH3  (via drill 0.3 pad 0.46)
  Top 0.203: J601.22 7.57,40.28 v8.05,40.28 | v8.41,37.19 15.06,37.19 18.59,40.72 19.35,40.72 U501.58
  Bottom 0.203: v8.05,40.28 8.05,37.54 v8.41,37.19
IO-CH4
  Top 0.203: J601.19 7.49,37.82 14.83,37.82 18.31,41.3 19.23,41.3 U501.59
IO-CH5
  Top 0.203: U501.22 11.2,33.27 8.61,33.27 7.95,33.93 7.95,34.82 J601.16
IO-CH6
  Top 0.203: U501.23 11.43,32.79 7.44,32.79 J601.13
IO-CH7
  Top 0.203: U501.26 12.1,31.34 J601.10
IO-CH8
  Top 0.203: U501.27 12.35,30.89 8.43,30.89 J601.7
IO-RPI-SPI_MISO  (via drill 0.3 pad 0.46)
  Top 0.203: U101.P$21 31.88,49.35 21.16,49.35 v20.57,48.77 | v20.07,39.37 20.07,40.01 U501.56 21.89,41.83 23.96,41.83 R503.P$1 | U102.2 42.65,45.41 42.32,45.09 v41.4,45.09 | U304.6 55.66,30.9 v55.8,30.76 U302.7 | U301.4 54.79,39.54 v54.2,40.13 | U303.9 53.34,43.13 v53.09,43.38
  Bottom 0.203: v20.57,48.77 20.57,39.88 v20.07,39.37 | U101.P$21 33.76,49.28 34.31,48.72 39.67,48.72 41.4,46.99 v41.4,45.09 41.4,42.72 42.19,41.94 48.31,41.94 49.76,43.38 v53.09,43.38 53.54,42.93 54.2,42.93 54.56,42.57 54.56,41.07 54.2,40.72 v54.2,40.13 54.2,39.52 54.53,39.19 54.53,35.43 56.24,33.73 56.24,31.19 v55.8,30.76
IO-RPI-SPI_MOSI  (via drill 0.3 pad 0.46)
  Top 0.203: U101.P$19 29.77,49.78 20.32,49.78 19.81,49.28 v19.81,48.26 | v19.41,40.06 U501.57 | U302.6 56.3,30.32 v56.72,30.73 56.91,30.93 U304.7 | U303.24 57.92,43.93 v58.24,44.25 | v42.52,43.81 40.46,43.81 40.11,43.46 U102.5 | U301.3 55.68,39.97 v55.07,40.59
  Bottom 0.203: v19.81,48.26 19.81,40.46 v19.41,40.06 | U101.P$19 32.49,52.5 34.49,52.5 35.03,51.97 35.03,49.78 35.56,49.25 40.01,49.25 42.52,46.74 v42.52,43.81 42.52,42.95 42.93,42.55 48.13,42.55 50.32,44.73 54.79,44.73 55.07,44.73 | v56.72,30.73 56.72,33.96 55.07,35.61 v55.07,40.59 55.07,44.73 | 55.07,44.73 57.76,44.73 v58.24,44.25
IO-RPI-SPI_NSS  (via drill 0.3 pad 0.46)
  Top 0.203: U101.P$26 37.59,52.53 37.59,50.16 35.87,48.44 22.89,48.44 v22.61,48.16 | v22.15,37.85 U501.50
  Bottom 0.203: v22.61,48.16 21.59,47.14 21.59,40.64 22.15,40.08 v22.15,37.85
IO-RPI-SPI_SCK  (via drill 0.3 pad 0.46)
  Top 0.203: v21.08,39.12 21.08,40.32 U501.55 22.14,41.38 22.84,41.38 23.98,40.23 JX502.6 | v21.49,48.49 21.89,48.9 33.96,48.9 U101.P$23 | U302.4 57.75,29.15 57.84,29.23 57.84,30.33 v58.14,30.63 58.16,30.65 U304.8 | v43.26,43.18 41.76,43.18 41.38,42.8 U102.6 | U303.23 59.02,43.53 v59.03,43.54 | U301.2 56.33,40.29 v56.03,40.59
  Bottom 0.203: v21.08,39.12 21.08,48.08 v21.49,48.49 | U101.P$23 36.3,50.29 36.83,49.76 40.44,49.76 43.26,46.94 v43.26,43.18 48.01,43.18 50.09,45.26 58.32,45.26 58.65,44.93 58.9,44.68 59.03,44.55 v59.03,43.54 56.16,43.54 55.58,42.95 55.58,41.05 v56.03,40.59 56.03,39.88 55.6,39.45 55.6,35.81 57.23,34.19 57.23,31.55 v58.14,30.63
IO-SWCLK
  Top 0.203: JX502.4 23.96,38.96 U501.49
IO-SWDIO
  Top 0.203: U501.46 23.62,34.67 24.69,34.67 27.71,37.69 JX502.2
IO-USART1_RX  (via drill 0.3 pad 0.46)
  Top 0.203: J501.P$3 3.78,13.59 v4.37,14.17 | U501.43 22.44,33.73 v24,33.73
  Bottom 0.203: 2.11,11.43 JX501.2 3.3,11.43 4.37,12.5 v4.37,14.17 5.64,14.17 7.11,12.7 7.11,5.33 8.64,3.81 17.53,3.81 18.52,4.8 18.52,6.78 14.22,11.07 14.22,14.99 17.27,18.03 30.66,18.03 31.55,18.92 31.55,21.46 30.48,22.53 30.48,27.48 25.98,31.98 24.51,31.98 24,32.49 v24,33.73
IO-USART1_TX  (via drill 0.3 pad 0.46)
  Top 0.203: U501.42 22.16,33.3 22.86,33.3 v23.19,32.97
  Bottom 0.203: JX501.1 3.05,13.97 3.96,14.88 6.04,14.88 7.62,13.31 7.62,5.69 9.02,4.29 17.4,4.29 18.03,4.93 18.03,6.58 13.72,10.9 13.72,15.27 16.94,18.49 30.45,18.49 31.06,19.1 31.06,21.26 30,22.33 30,27.28 25.73,31.55 23.82,31.55 23.19,32.18 v23.19,32.97
IO-USART2_RX  (via drill 0.3 pad 0.46)
  Top 0.203: v14.68,36.2 14.3,36.58 10.97,36.58 U501.17 | v21.36,25.45 22.12,24.69 22.12,19.74 21.7,19.32 U201.4
  Bottom 0.203: v21.36,25.45 18.8,25.45 17.48,26.77 17.48,33.4 v14.68,36.2
IO-USART2_TX  (via drill 0.3 pad 0.46)
  Top 0.203: U501.16 10.14,38.51 v9.55,38.51 | v20.45,26.04 20.45,25.17 21.69,23.93 21.69,20.07 21.44,19.81 U201.5
  Bottom 0.203: v20.45,26.04 18.87,26.04 17.93,26.98 17.93,33.91 14.91,36.93 11.12,36.93 v9.55,38.51
IO-VDD_3V3  (via drill 0.3, 0.3 pad 0.46)
  Top 0.203: U501.19 10.16,34.35 v10.16,34.04 9.46,34.04 C507.P$1 | U601.8 11.52,24.65 11.89,24.28 14.19,24.28 C601.P$1 16.3,23.59 v16.66,23.95 17.04,24.33 18.97,24.33 19.55,23.76 C201.P$1 19.8,23.37 U201.10 19.8,18.55 19.81,18.54 | U201.19 17.81,18.32 18.03,18.54 19.81,18.54 | 19.81,18.54 20.04,18.54 20.27,18.31 U201.2 | U102.8 43.92,39.64 C101.P$1 v43.93,38.79 v43.94,38.79 | U501.32 16.06,30.28 C502.P$1 16.06,29.13 v16.92,28.27 | U501.64 17.54,44.92 C504.P$1 17.54,44.92 v17.04,44.42 16.06,44.42 U501.1 | U501.13 12.19,39.03 v12.19,38.61 | C503.P$1 v24.97,36.02 24.51,35.56 24.14,35.56 U501.48 | U102.8 U102.7 | U102.3 41.38,46.02 40.74,45.39 40.74,44.76 41.05,44.45 43.36,44.45 43.92,43.89 U102.8 | JX502.1 v32.51,36.09 31.98,36.09 U401.1 | C706.P$1 38.67,32.02 37.92,32.77 35.31,32.77 34.47,33.6 33.1,33.6 32.77,33.28 C401.P$1 32.72,32.84 U401.10 | R503.P$2 v25.91,41.76
  Top 0.254: 40.15,28.73 U701.8 40.15,29.1 39.5,29.74 v39.5,30.2 C707.P$1 C706.P$1 v39.5,31.83
  Top 0.305: J402.1 48.25,4.71 46.63,6.33 46.63,12.83 v47.42,13.61 47.9,14.1 D401.C
  pour Power (isolate 0.305): 41.53,33.07 41.53,28.52 47.62,28.52 47.62,23.29 65.1,23.29 65.1,0 0,0 0,55.98 65.1,55.98 65.1,48.51 47.62,48.51 47.62,33.07
IO_AUX_ADC1  (via drill 0.3 pad 0.46)
  Top 0.203: R208.P$1 28.55,16.18 27.89,16.84 26.82,16.84 24.43,19.23 24.43,24.66 v24.03,25.07 | U501.24 13.81,34.47 v15.42,34.47
  Bottom 0.203: v24.03,25.07 23.06,25.07 22.73,24.74 18.85,24.74 16.33,27.25 16.33,30.07 15.42,30.99 v15.42,34.47
IO_AUX_ADC2  (via drill 0.3 pad 0.46)
  Top 0.203: R207.P$1 27.3,15.67 23.7,19.28 v23.7,24.08 | v14.68,33.81 13.86,33.81 U501.25
  Bottom 0.203: v23.7,24.08 18.9,24.08 15.9,27.08 15.9,29.79 14.68,31.01 v14.68,33.81
LED-!RESET
  Top 0.203: U101.P$7 15.98,48.03 16.66,47.35 21.67,47.35 23.93,45.09 35.15,45.09 37.59,42.65 37.59,35.13 36.55,34.09 30.61,34.09 29.98,34.71 U401.4
MAG_DRDY  (via drill 0.3 pad 0.46)
  Top 0.203: U302.9 52.99,29.65 52.78,29.44 v51.87,29.44
  Bottom 0.203: U101.P$13 25.7,49.12 28.12,49.12 30.38,46.86 35.66,46.86 38.08,44.45 38.08,41.33 45.97,33.43 45.97,31.14 47.68,29.44 v51.87,29.44
MPU_DRDY  (via drill 0.3 pad 0.46)
  Top 0.203: U303.12 53.91,41.93 v53.75,42.09
  Bottom 0.203: U101.P$18 29.92,52.53 29.92,49.63 31.34,48.21 39.32,48.21 40.31,47.22 40.31,42.44 41.4,41.35 50.49,41.35 51.23,42.09 v53.75,42.09
N$1
  Top 0.203: L702.P$2 14.74,20.6 R701.P$2
N$2
  Top 0.203: L701.P$2 11.93,20.58 R702.P$2
N$3
  Top 0.203: R604.P$1 R605.P$2
N$4
  Top 0.203: D203.C
  Top 0.305: D203.C L203.P$2 | J203.1 23.92,14.02 D203.C
N$5
  Top 0.203: D201.C 7.72,14.46
  Top 0.305: 7.72,14.46 L201.P$2 10.08,13.43 J201.1
N$6
  Top 0.203: U302.15 55.8,26.26 55.09,25.55 C309.P$1
N$7  (via drill 0.3 pad 0.46)
  Top 0.203: R211.P$2 40.44,13.74 v40.66,13.51 | v37.74,6.53 37.74,4.72 J205.2
  Bottom 0.203: v40.66,13.51 40.66,9.45 v37.74,6.53
N$8  (via drill 0.3 pad 0.46)
  Top 0.203: R212.P$2 v41.71,13.54 | v38.99,6.55 J205.3
  Bottom 0.203: v41.71,13.54 41.71,9.27 v38.99,6.55
N$9  (via drill 0.3 pad 0.46)
  Top 0.203: LED403.C 30.47,45.97 v28.8,45.97 | R410.P$2 22.68,29.52 23.11,29.95 24.61,29.95 24.92,30.25 24.92,31.01 26.24,32.33 v26.24,33.3
  Bottom 0.203: v28.8,45.97 27.66,44.83 27.66,36.52 26.24,35.1 v26.24,33.3
N$10
  Top 0.203: U302.2 58.24,28.15 C310.P$1
N$11
  Top 0.305: D204.C L204.P$2 33.81,12.22 | 33.81,12.22 33.02,11.43 33.02,5.54 33.86,4.7 36.47,4.7 J205.1 | 33.81,12.22 36.96,12.22 J204.1
N$14  (via drill 0.3 pad 0.46)
  Top 0.203: R205.P$2 29.82,13.84 v30.07,13.59 | v27.05,6.66 J202.4
  Bottom 0.203: v30.07,13.59 30.07,9.68 v27.05,6.66
N$15
  Top 0.203: U303.10 53.42,42.73 53.02,42.33 C313.P$1
N$17
  Top 0.203: U302.3 58.01,28.65 58.24,28.88 58.24,29.62 58.46,29.84 C310.P$2
N$18
  Top 0.203: U501.6 C506.P$2 X501.1
N$19  (via drill 0.3 pad 0.46)
  Top 0.203: R206.P$2 v31.11,13.59 | v28.3,6.68 J202.5
  Bottom 0.203: v31.11,13.59 31.11,9.5 v28.3,6.68
N$22
  Top 0.203: U501.5 13.52,43.36 C505.P$1 11.68,46.03 X501.3
N$24  (via drill 0.3 pad 0.46)
  Top 0.203: R406.P$1 R405.P$2 v56.34,21.59 | U402.2 v54.92,13.77 v54.91,13.77
  Bottom 0.203: v54.91,13.77 54.91,20.17 v56.34,21.59
N$25
  Top 0.203: U402.8 54.27,19.14 R402.P$1 53.76,19.46 R403.P$2
N$27
  Top 0.203: C403.P$1 R403.P$1
  Top 0.305: U402.1 54.27,15.33 53.93,15.66 C403.P$1 52.21,15.66 51.45,14.89 J401.1
N$28
  Top 0.203: U402.7 54.92,19.22 R401.P$1
N$29
  Top 0.203: LED401.C R407.P$2
N$32
  Top 0.305: L401.P$2 57.28,16.64 56.61,17.3 U402.5
N$35
  Top 0.203: U301.14 59.12,37.32 C304.P$1
N$36
  Top 0.203: U402.6 55.57,18.67 R405.P$1 57.49,18.29 C404.P$1
N$38
  Top 0.203: R601.P$2 11.75,26.92 10.77,26.92 10.06,26.21 R603.P$1 D602.C 10.36,25.2 11.73,23.82 12.57,23.82 12.82,23.58 U601.3
N$39
  Top 0.203: R409.P$2 R408.P$1
N$40  (via drill 0.3 pad 0.46)
  Top 0.203: LED402.C 25.41,45.97 v26.57,45.97 | R408.P$2 24.25,31.36 v25.58,32.69
  Bottom 0.203: v26.57,45.97 27.18,45.36 27.18,36.78 25.58,35.18 v25.58,32.69
N$57
  Top 0.203: R411.P$1 49.15,14.33 47.17,12.34 47.17,7.34 48.26,6.25 51.69,6.25 52.07,5.87 J402.2
N$70
  Top 0.203: U201.20 18.3,16.89 R201.P$1
N$82
  Top 0.203: U201.18 16.78,18.82 16.51,18.54 16.51,16.37 R202.P$1
N$83
  Top 0.203: U201.17 16.52,19.32 16,18.8 16,16.51 15.34,15.85 R203.P$1
N$84
  Top 0.203: U201.16 16.31,19.82 15.57,19.07 15.57,17.22 15.18,16.83 15.06,16.71 14.86,16.51 12.26,16.51 R204.P$1
N$95
  Top 0.203: U401.6 28.43,32.84 R404.P$2
N$99
  Top 0.203: R603.P$2 6.4,26.21 J601.4
N$100  (via drill 0.3 pad 0.46)
  Top 0.203: D202.C L202.P$2
  Top 0.305: L202.P$2 23.01,13.84 v22.58,13.41 | v23.29,7.26 J202.1
  Bottom 0.305: v22.58,13.41 22.58,7.98 v23.29,7.26
N$104
  Top 0.254: U701.6 41.35,27.39 C702.P$1
PPM-SBUS-PROT
  Top 0.203: R602.P$2 6.81,24.18 J601.1
PPM_INPUT  (via drill 0.3 pad 0.46)
  Top 0.203: D601.C R602.P$1 v10.52,24.18 11.35,23.34 11.91,23.34 12.17,23.08 U601.2 | U501.41 22.24,32.51 v22.43,32.51
  Bottom 0.203: v10.52,24.18 10.52,22.81 10.03,22.33 8.15,22.33 6.55,20.73 6.55,19.48 7.39,18.64 14.81,18.64 16.64,20.47 26.75,20.47 28.75,22.48 28.75,24.13 28.75,24.21 28.75,27.86 25.63,30.99 23.11,30.99 22.43,31.67 v22.43,32.51
PRESSURE_SENS  (via drill 0.3 pad 0.46)
  Top 0.203: 36.89,15.11 R210.P$2 35.7,17.02 33.93,17.02 32.69,18.26 27.84,18.26 26.14,19.96 v26.14,23.34 | 36.89,15.11 R209.P$1 | C202.P$1 38.68,14.87 38.41,15.14 36.91,15.14 36.89,15.11 | v13.23,38.86 12.93,39.17 12.93,39.7 U501.11
  Bottom 0.203: v26.14,23.34 26.14,23.98 23.32,26.8 18.97,26.8 18.47,27.3 18.47,34.14 14.53,38.08 14.02,38.08 v13.23,38.86
PRESSURE_SENS_IN
  Top 0.203: R209.P$2 37.89,13.6 | 37.89,13.6 38.35,13.13 J204.2 | 37.89,13.6 ADC_PR.P$1
RGB_LED_3
  Top 0.305: U401.9 30.98,32.42 31.58,31.82 U403.C1
  pour Top (isolate 0.305, no thermals): 31.34,31.83 31.34,28.96 33.78,28.96 33.78,31.83
RGB_LED_4
  Top 0.305: U401.8 U403.C2
  pour Top (isolate 0.305, no thermals): 30.23,31.85 30.23,28.96 30.73,28.96 30.73,31.85
RGB_LED_14
  Top 0.305: U401.7 29.98,32.39 29.38,31.79 U403.C3
  pour Top (isolate 0.305, no thermals): 29.64,31.83 27.18,31.83 27.18,28.96 29.64,28.96
RPI-I2C_SCL  (via drill 0.3)
  Top 0.203: U101.P$5 13.44,49.4 15.95,46.89 21.39,46.89 23.7,44.58 34.9,44.58 36.96,42.52 v36.96,36.07 36.96,35.46 36.04,34.54 30.84,34.54 30.48,34.9 U401.3 | v39.62,36.07 41.07,36.07 44.27,32.87 44.27,23.29 41.22,20.24 41.22,16.25 R211.P$1
  Bottom 0.203: v39.62,36.07 v36.96,36.07
RPI-I2C_SDA  (via drill 0.3)
  Top 0.203: U101.P$3 15.75,46.38 21.21,46.38 23.47,44.12 34.67,44.12 36.3,42.49 v36.3,37.01 36.3,35.69 35.59,34.98 31.17,34.98 30.98,35.16 U401.2 | v38.58,37.01 40.84,37.01 44.76,33.1 44.76,23.06 41.71,20.02 R212.P$1
  Bottom 0.203: v38.58,37.01 v36.3,37.01
RPI-UART_RX  (via drill 0.3 pad 0.46)
  Top 0.203: v24.84,28.57 22.99,26.72 22.99,19.05 21.75,17.82 U201.1 19.81,17.8
  Bottom 0.203: U101.P$10 17.25,52.5 17.25,50.47 14.22,47.45 14.22,43.89 16.92,41.2 16.92,39.5 20.83,35.59 20.83,29.87 21.18,29.52 24.36,29.52 24.84,29.03 v24.84,28.57
RPI-UART_TX  (via drill 0.3 pad 0.46)
  Top 0.203: U201.3 21.99,18.82 22.55,19.38 22.55,27.46 v23.95,28.85
  Bottom 0.203: U101.P$8 14.71,52.5 14.71,48.74 13.72,47.75 13.72,43.48 16.36,40.84 16.36,39.4 20.34,35.41 20.34,29.26 20.75,28.85 v23.95,28.85
RSSI_IN  (via drill 0.3 pad 0.46)
  Top 0.203: R601.P$1 12.34,29.67 v12.83,30.15 | U501.21 12.43,35.2 v13.87,35.2 14.76,35.2 15.06,35.51 22.07,35.51 U501.45
  Bottom 0.203: v12.83,30.15 12.83,32.05 13.87,33.1 v13.87,35.2
RX-VDD_5V5  (via drill 0.3 pad 0.46)
  Top 0.406: F701.2 v34.16,18.14
  Power 0.406: J601.2 3.81,22.86 5.33,21.34 30.96,21.34 v34.16,18.14
SAFETY  (via drill 0.3 pad 0.46)
  Top 0.203: U501.38 21.16,31.47 23.39,31.47 25.96,34.04 v27,34.04 | J402.3 53.31,6.12 52.76,6.68 48.49,6.68 47.65,7.52 47.65,11.99 50.3,14.64 R412.P$1 51.13,15.38 v51.13,16.71
  Bottom 0.203: v51.13,16.71 51.13,17.45 49.63,18.95 49.63,25.25 44.45,30.43 44.45,33.05 43.38,34.11 34.87,34.11 33.98,33.22 27.81,33.22 v27,34.04
SBUS_INPUT
  Top 0.203: U601.6 12.82,25.33 13.08,25.07 14.4,25.07 15.52,26.19 15.52,28.52 14.48,29.57 14.48,30.89 U501.30
SBUS_OUTPUT
  Top 0.203: U501.29 14.05,31.17 14.05,29.34 15.06,28.32 15.06,26.64 14.5,26.08 U601.5
SERIAL1_RX
  Top 0.203: 12.58,14.48 J201.3 | S1RX.P$1 12.58,14.48 | R203.P$2 12.58,14.96 12.58,14.48
SERIAL1_TX
  Top 0.203: R204.P$2 10.6,14.8 S1TX.P$1 11.33,14.07 J201.2
SERIAL2_RX  (via drill 0.3 pad 0.46)
  Top 0.203: R201.P$2 20.34,13.73 S2RX.P$1 19.36,12.7 v20.14,11.91 | v25.81,6.22 25.81,4.72 J202.3
  Bottom 0.203: v20.14,11.91 20.14,7.06 20.55,6.66 25.38,6.66 v25.81,6.22
SERIAL2_TX  (via drill 0.3 pad 0.46)
  Top 0.203: R202.P$2 S2TX.P$1 | S2TX.P$1 | S2TX.P$1 v18.03,13.45 v18.03,13.44 | v24.54,6.04 J202.2
  Bottom 0.203: v18.03,13.44 18.03,12.39 19.71,10.72 19.71,6.83 20.5,6.04 v24.54,6.04
VDD_3V3_SENSORS  (via drill 0.3, 0.3 pad 0.46)
  Top 0.203: C302.P$1 60.81,37.74 60.36,38.19 C301.P$1 59.77,37.97 U301.15 U301.16 57.91,39.11 | U302.14 55.3,27.11 55.12,26.92 v53.59,26.92 | C306.P$1 58.01,25.66 v58.01,27.41 | 57.91,39.11 v58.34,39.55 | U301.1 57.48,39.54 57.91,39.11 | U304.1 v59.17,33.92 v59.18,33.91 C308.P$1 | U302.1 57.77,27.65 v58.01,27.41 | C307.P$1 58.27,27.66 v58.01,27.41 | U303.13 55.01,41.49 54.02,41.49 v53.67,41.15 53.54,41.27 52.67,41.27 C314.P$1 51.28,41.31 C315.P$1 | U303.1 57.01,45.72 C312.P$1 v57.72,46.48 v57.73,46.48 | U303.8 54.19,43.53 53.77,43.94 v53.77,44.09
  Top 0.254: U701.7 40.59,27.89 42.2,29.5 C703.P$1 v43.03,30.2 | C704.P$1 v43.03,31.83
  pour Power (isolate 0.305): 42.16,32.51 42.16,29.08 48.26,29.08 48.26,23.85 65.07,23.85 65.07,48.01 48.26,48.01 48.26,32.51
VDD_3V3_SPEKTRUM  (via drill 0.3)
  Top 0.254: D501.C 6.6,13.61 7.14,13.08 7.14,11.86 6.1,10.82 v6.1,9.93 v6.09,9.93 J501.P$1 | U702.8 40.22,25.49 v40.74,26.01 41.33,25.43 C709.P$1
  Bottom 0.254: v6.1,9.93 6.58,9.45 6.58,5.08 8.36,3.3 32,3.3 35.56,6.86 35.56,15.75 38.3,18.49 38.3,21.49 40.74,23.93 v40.74,26.01
VDD_3V3_SPEKTRUM_EN  (via drill 0.3)
  Top 0.203: U702.5 40.75,23.99 40.97,24.21 R707.P$2 41.44,23.66 41.83,23.27 43.31,23.27 43.79,23.75 43.79,32.66 41.43,35.03 v38.68,35.03 | U501.39 21.44,31.9 23.16,31.9 26.29,35.03 v27.79,35.03
  Bottom 0.203: v27.79,35.03 v38.68,35.03
VDD_5V_BRICK  (via drill 0.3 pad 0.46)
  Top 0.406: VDD_5V_BRICK.P$1 9.18,4.71 J701.1 | J701.2 11.33,6.45 v10.92,6.86 | J701.1 10.08,6.43 v9.65,6.86 | J701.1 11.31,4.71 11.43,4.83 | D701.A v36.88,19.81
  Power 0.406: v9.65,6.86 v10.92,6.86 12.95,8.89 34.8,8.89 36.88,10.97 v36.88,19.81
VDD_5V_IN  (via drill 0.3)
  Top 0.203: R705.P$2 31.47,22.02 F702.1 | VDD_5V_IN.P$1 v59.38,13.39
  Top 0.254: U701.5 40.15,26.61 39.98,26.44 38.71,26.44 38.55,26.61 U701.4 37.88,26.89 37.69,26.7 C701.P$1 | U403.A1 31.58,25.98 34.16,23.39 F701.1 | U701.1 36.76,28.39 36.74,28.36 | U702.1 37.96,25.49 37.54,25.07 C705.P$1
  Top 0.305: 59.4,15.49 C402.P$1 v59.4,13.4 v59.38,13.39 | 59.4,15.49 59.4,16.18 L401.P$1 | U402.3 55.57,15.79 55.85,16.08 56.82,16.08 57.3,15.6 59.3,15.6 59.4,15.49 | LED403.A LED401.A LED402.A 24.25,47.49 v23.72,46.97 | D702.C 41.34,22.04 v41.35,22.02
  Top 0.406: U403.A3 U403.A2 U403.A1 | F702.1 F701.1 34.2,22.04 D701.C | D702.C D701.C | v35.08,30.02 36.74,28.36 C701.P$1 36.75,26.69 C705.P$1 D703.C 36.75,22.17 D701.C
  Power 0.406: U101.P$2 U101.P$4 12.17,52.5 12.17,49.3 14.5,46.97 v23.72,46.97 23.72,41.38 v35.08,30.02
  Bottom 0.305: v41.35,22.02 46.3,22.02 47.14,21.18 47.14,15.32 49.68,12.78 58.78,12.78 v59.38,13.39
  pour Top (isolate 0.305, no thermals): 29.64,27.51 27.18,27.51 27.18,23.88 29.64,23.88
  pour Top (isolate 0.305, no thermals): 30.23,27.53 30.23,23.88 30.73,23.88 30.73,27.53
  pour Top (isolate 0.305, no thermals): 31.34,27.51 31.34,23.88 33.78,23.88 33.78,27.51
VDD_5V_PERIPH  (via drill 0.3 pad 0.46)
  Top 0.406: L204.P$1 33.64,16.14 v32.77,17.02 | v9.07,16.99 9.07,16.09 L201.P$1 | L202.P$1 23.01,16.87 v22.86,17.02 | L203.P$1 25.58,16.33 v24.89,17.02 | F702.2 v29.95,19.2
  Power 0.406: v32.77,17.02 29.72,17.02 | 29.72,17.02 v24.89,17.02 v22.86,17.02 16.76,17.02 16.26,16.51 9.55,16.51 v9.07,16.99 | v29.95,19.2 29.72,18.97 29.72,17.02
VDD_5V_SENS  (via drill 0.3 pad 0.46)
  Top 0.203: v27.94,19.81 28.3,20.18 R706.P$1 R705.P$1 | v11.3,41.66 11.68,41.66 U501.10
  Bottom 0.203: v27.94,19.81 16.71,19.81 15.06,18.16 7.11,18.16 6.04,19.23 6.04,21.06 9.4,24.41 9.4,34.54 10.67,35.81 10.67,36.68 9.75,37.59 9.22,37.59 8.64,38.18 8.64,38.99 v11.3,41.66
VDD_SERVO  (via drill 0.3 pad 0.46)
  Top 0.203: J601.29 3.81,46.99 VDD_SERVO.P$1 | R604.P$2 3.98,27.52 3.81,27.69
  Top 0.406: D702.A v39.62,19.81
  Top 1.778: J601.5 3.81,27.69 J601.8 J601.11 J601.14 J601.17 J601.20 J601.23 J601.26 J601.29
  Power 0.406: J601.5 5.08,24.99 5.08,22.89 5.87,22.1 37.34,22.1 v39.62,19.81
  Bottom 1.778: J601.29 J601.5
VDD_SERVO_SENS  (via drill 0.3 pad 0.46)
  Top 0.203: R605.P$1 10.41,27.52 | 10.41,27.52 R606.P$2 | U501.20 12.33,35.81 v12.83,35.81 | v10.49,29.54 10.49,27.59 10.41,27.52
  Bottom 0.203: v12.83,35.81 12.83,32.77 10.49,30.43 v10.49,29.54

## Text on the board
tPlace: RASPILOTv1.1